# Altium schematic sheet AnalogFrontEnd.SchDoc
size A4; SheetNumber: 9; SheetTotal: 15
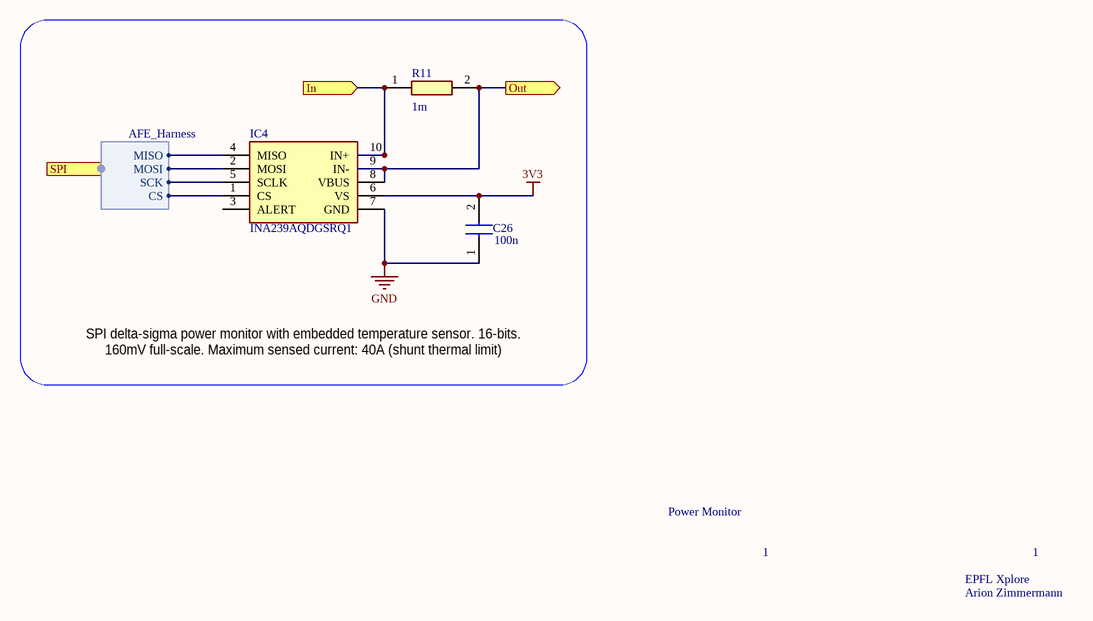
[diagram p0: AnalogFrontEnd.SchDoc]

## Parts
C26  value 100n  [CAPC1608X95N]  (hidden comment: C0603C104K5RACTU)
IC4  INA239AQDGSRQ1  [SOP50P490X110-10N]
R11  value 1m  [RESC6430X90N]  (hidden comment: PCS2512FR0010ET)

## Ports
In (in), Out (out), SPI (harness AFE_Harness)

## Harnesses
AFE_Harness: SCK, MISO, MOSI, CS

## Nets
3V3: C26.2 IC4.6(VS)
GND: C26.1 IC4.7(GND)
In: IC4.10(IN+) R11.1 ; port In
Out: IC4.8(VBUS) IC4.9(IN-) R11.2 ; port Out
NetIC4_1: IC4.1(CS) ; port SPI.CS
NetIC4_2: IC4.2(MOSI) ; port SPI.MOSI
NetIC4_4: IC4.4(MISO) ; port SPI.MISO
NetIC4_5: IC4.5(SCLK) ; port SPI.SCK

Not connected (* = marked no-connect by the designer): IC4 3(ALERT)

## Notes on the sheet
- SPI delta-sigma power monitor with embedded temperature sensor. 16-bits. 160mV full-scale. Maximum sensed current: 40A (shunt thermal limit)
- Power Monitor
- 1
- EPFL Xplore
- Arion Zimmermann

## Library data of the parts
C26 = C0603C104K5RACTU: Capacitor; Manufacturer_Name: Kemet; Datasheet Link: http://www.farnell.com/datasheets/2205446.pdf; Height: 0.95mm; Manufacturer_Part_Number: C0603C104K5RACTU; Mouser Part Number: 80-C0603C104K5R; Mouser Price/Stock: https://www.mouser.co.uk/ProductDetail/KEMET/C0603C104K5RACTU?qs=l5k%252BbMnNDkkVcnZPSAaaiQ%3D%3D; Arrow Part Number: C0603C104K5RACTU; Arrow Price/Stock: https://www.arrow.com/en/products/c0603c104k5ractu/kemet-corporation; Supplier 1: Mouser; Supplier Part Number 1: 80-C0603C104K5R
IC4 = INA229AQDGSRQ1: Integrated Circuit; Manufacturer_Name: Texas Instruments; Datasheet Link: https://www.ti.com/lit/ds/symlink/ina229-q1.pdf?ts=1625593362739; Height: 1.1mm; Manufacturer_Part_Number: INA229AQDGSRQ1; Mouser Part Number: 595-INA229AQDGSRQ1; Mouser Price/Stock: https://www.mouser.co.uk/ProductDetail/Texas-Instruments/INA229AQDGSRQ1?qs=QNEnbhJQKvYTGkxSAfXBrQ%3D%3D; Arrow Part Number: INA229AQDGSRQ1; Arrow Price/Stock: https://www.arrow.com/en/products/ina229aqdgsrq1/texas-instruments?region=nac; Supplier 1: Mouser; Supplier Part Number 1: 595-INA239AQDGSRQ1
R11 = PCS2512FR0010ET: Resistor; Manufacturer_Name: Ohmite; Datasheet Link: https://www.mouser.com/datasheet/2/303/res_pcs-1665423.pdf; Height: 0.904mm; Manufacturer_Part_Number: PCS2512FR0010ET; Mouser Part Number: 588-PCS2512FR0010ET; Mouser Price/Stock: https://www.mouser.co.uk/ProductDetail/Ohmite/PCS2512FR0010ET?qs=Zz7%252BYVVL6bExv9xLWZznUg%3D%3D